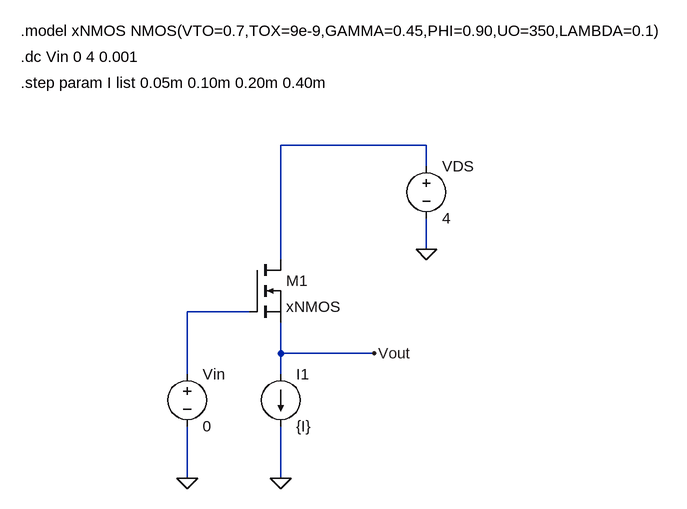
[diagram p0: schematic Chapter03_SPICE06.asc]
Chapter03_SPICE06.asc, the LTspice schematic file:
Version 4
SHEET 1 1244 868
WIRE 672 336 448 336
WIRE 672 368 672 336
WIRE 672 496 672 448
WIRE 448 512 448 336
WIRE 400 592 304 592
WIRE 448 656 448 608
WIRE 592 656 448 656
WIRE 304 688 304 592
WIRE 448 688 448 656
WIRE 304 848 304 768
WIRE 448 848 448 768
FLAG 448 848 0
FLAG 304 848 0
FLAG 672 496 0
FLAG 592 656 Vout
SYMBOL nmos 400 512 R0
SYMATTR InstName M1
SYMATTR Value xNMOS
SYMBOL voltage 304 672 R0
WINDOW 123 0 0 Left 0
WINDOW 39 0 0 Left 0
SYMATTR InstName Vin
SYMATTR Value 0
SYMBOL voltage 672 352 R0
WINDOW 123 0 0 Left 0
WINDOW 39 0 0 Left 0
SYMATTR InstName VDS
SYMATTR Value 4
SYMBOL current 448 688 R0
WINDOW 123 0 0 Left 0
WINDOW 39 0 0 Left 0
SYMATTR InstName I1
SYMATTR Value {I}
TEXT 48 160 Left 2 !.model xNMOS NMOS(VTO=0.7,TOX=9e-9,GAMMA=0.45,PHI=0.90,UO=350,LAMBDA=0.1)
TEXT 48 200 Left 2 !.dc Vin 0 4 0.001
TEXT 48 240 Left 2 !.step param I list 0.05m 0.10m 0.20m 0.40m

The netlist it stands for:
* Chapter03_SPICE06.asc
M1 N001 N002 Vout Vout xNMOS
Vin N002 0 0
VDS N001 0 4
I1 Vout 0 {I}
.model NMOS NMOS
.model PMOS PMOS
.lib standard.mos
.model xNMOS NMOS(VTO=0.7,TOX=9e-9,GAMMA=0.45,PHI=0.90,UO=350,LAMBDA=0.1)
.dc Vin 0 4 0.001
.step param I list 0.05m 0.10m 0.20m 0.40m
.backanno
.end